# Altium project Lipo-A.PrjPcb
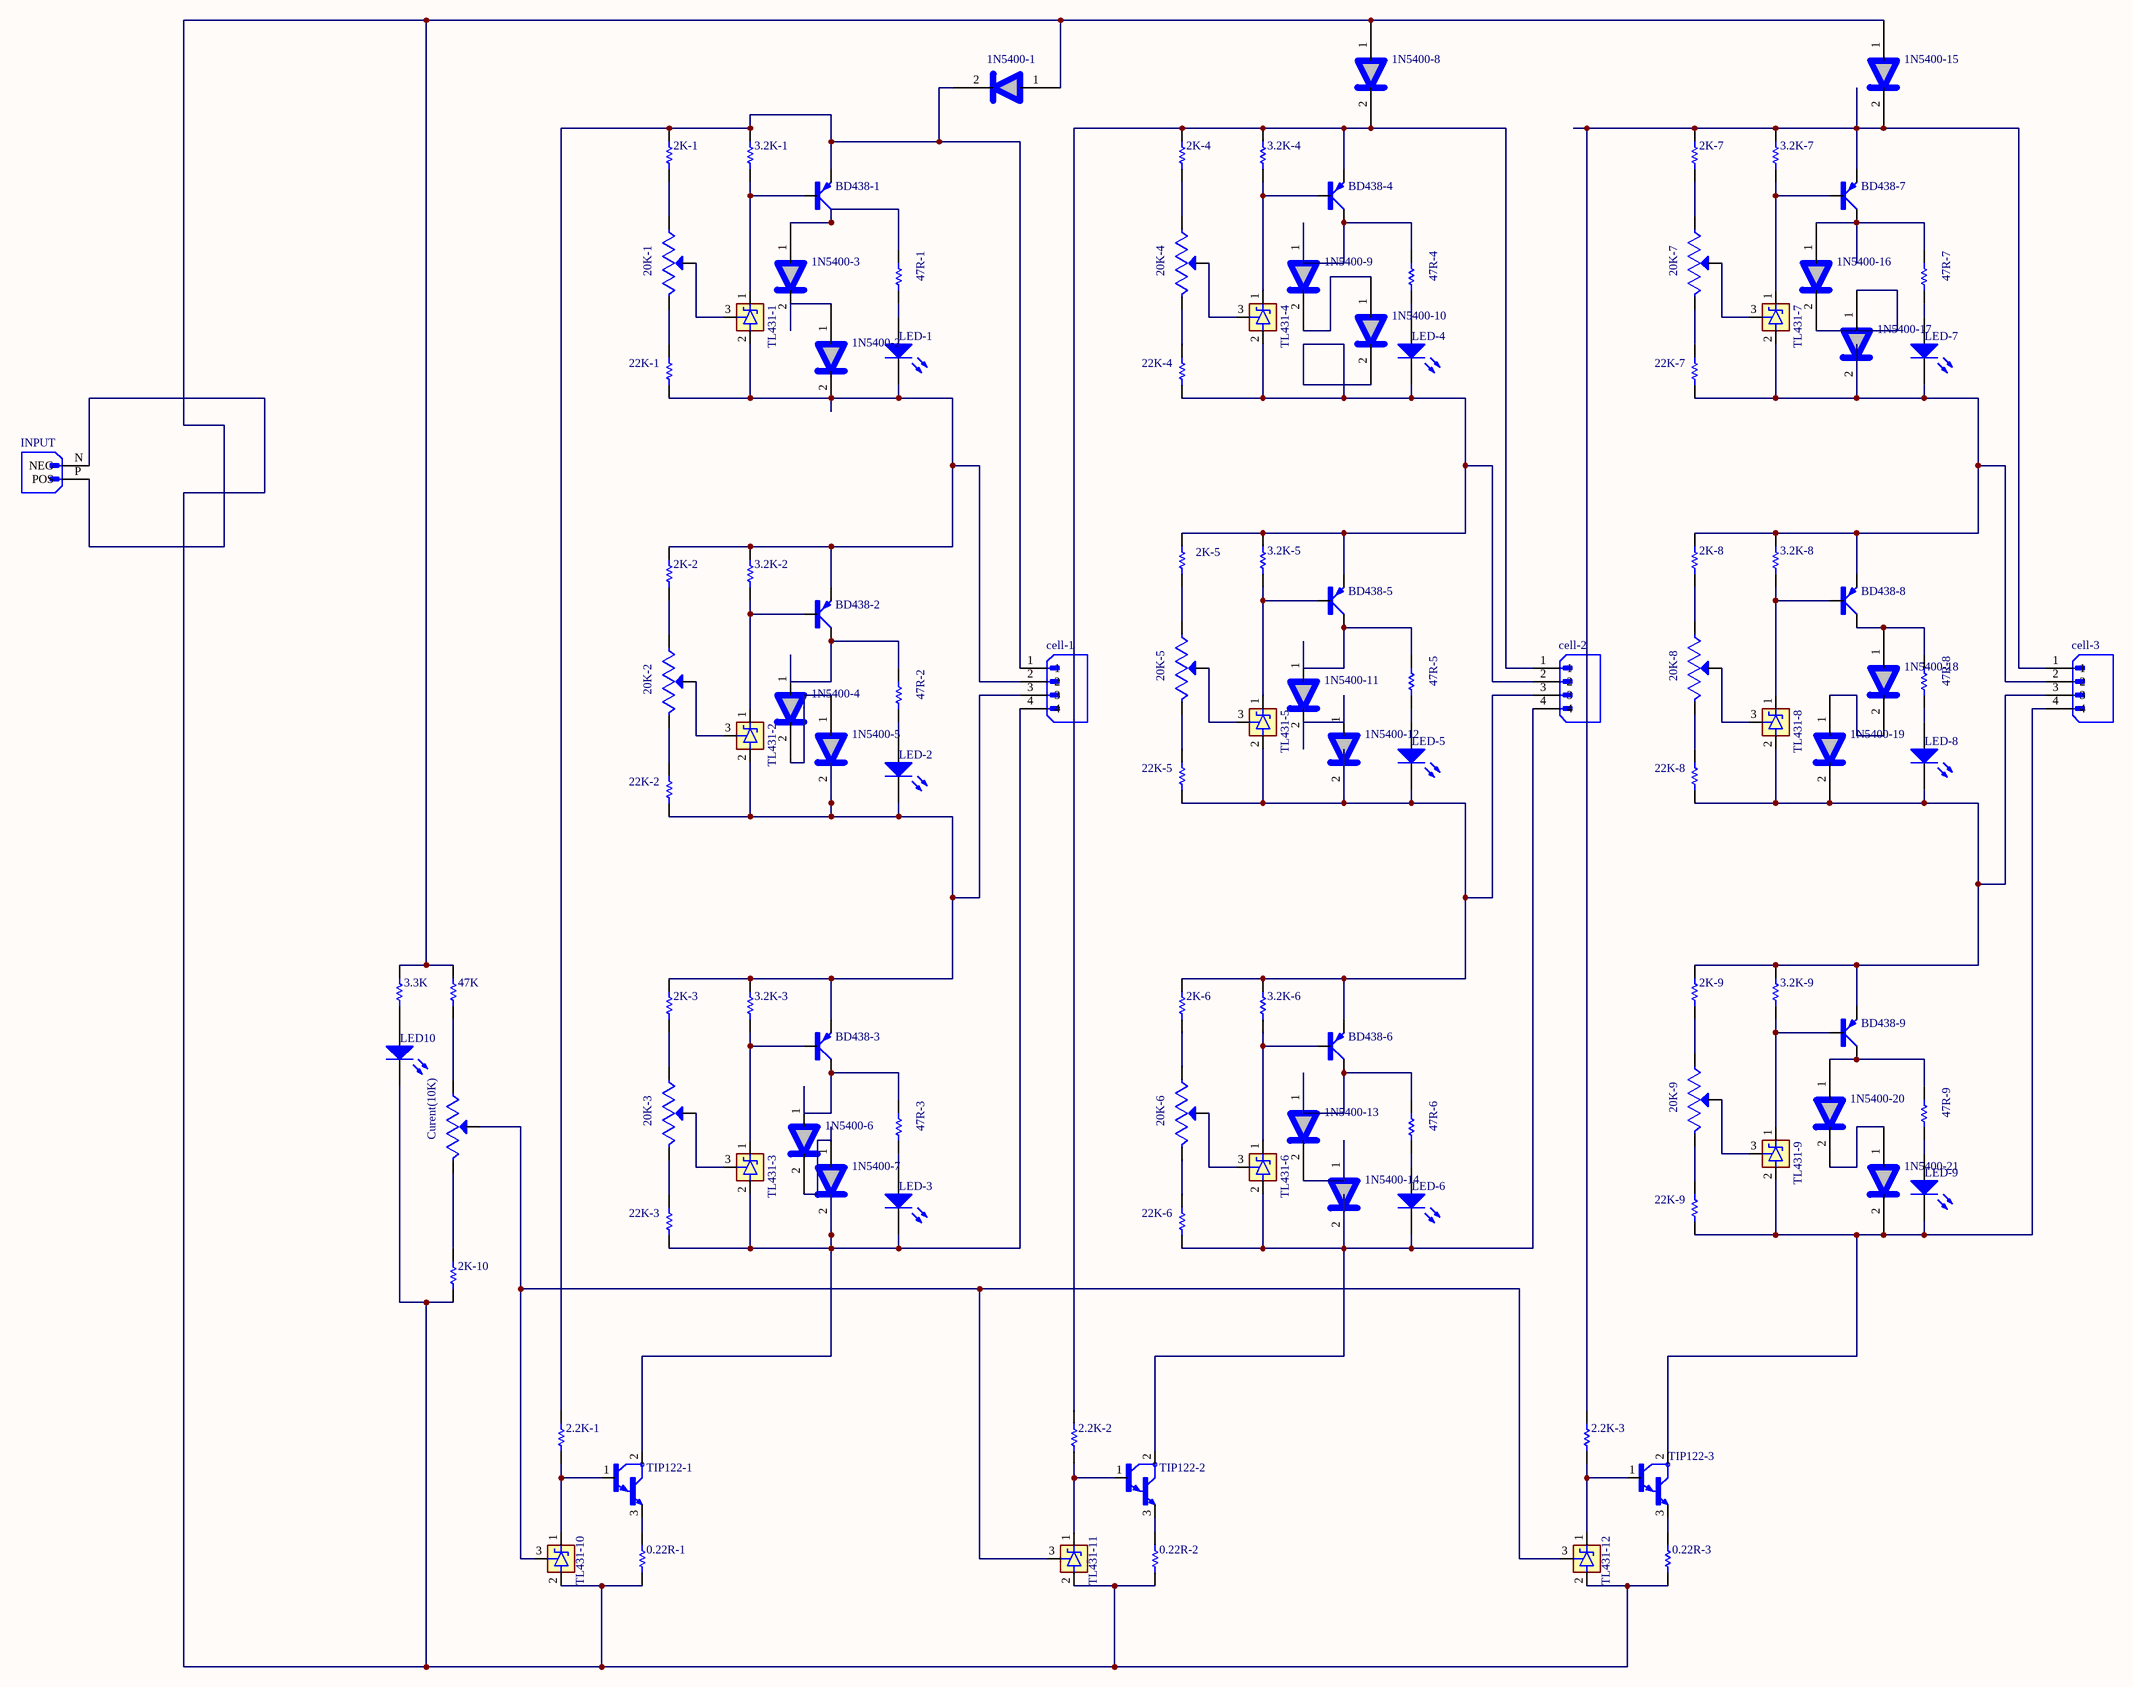
[diagram p0: Sheet2.SchDoc]
1 sheet, 114 parts. Net scope: global (net labels, ports and power ports of the same name join across sheets).
Board file: PCB1.PcbDoc

## Sheet Sheet2.SchDoc
size A2

### Parts
0.22R-1  (no value)  [AXIAL-0.3]
0.22R-2  (no value)  [AXIAL-0.3]
0.22R-3  (no value)  [AXIAL-0.3]
1N5400-1  (no value)  [PCBComponent_1]
1N5400-2  (no value)  [PCBComponent_1]
1N5400-3  (no value)  [PCBComponent_1]
1N5400-4  (no value)  [PCBComponent_1]
1N5400-5  (no value)  [PCBComponent_1]
1N5400-6  (no value)  [PCBComponent_1]
1N5400-7  (no value)  [PCBComponent_1]
1N5400-8  (no value)  [PCBComponent_1]
1N5400-9  (no value)  [PCBComponent_1]
1N5400-10  (no value)  [PCBComponent_1]
1N5400-11  (no value)  [PCBComponent_1]
1N5400-12  (no value)  [PCBComponent_1]
1N5400-13  (no value)  [PCBComponent_1]
1N5400-14  (no value)  [PCBComponent_1]
1N5400-15  (no value)  [PCBComponent_1]
1N5400-16  (no value)  [PCBComponent_1]
1N5400-17  (no value)  [PCBComponent_1]
1N5400-18  (no value)  [PCBComponent_1]
1N5400-19  (no value)  [PCBComponent_1]
1N5400-20  (no value)  [PCBComponent_1]
1N5400-21  (no value)  [PCBComponent_1]
2.2K-1  (no value)  [AXIAL-0.3]
2.2K-2  (no value)  [AXIAL-0.3]
2.2K-3  (no value)  [AXIAL-0.3]
2K-1  (no value)  [AXIAL-0.3]
2K-2  (no value)  [AXIAL-0.3]
2K-3  (no value)  [AXIAL-0.3]
2K-4  (no value)  [AXIAL-0.3]
2K-5  (no value)  [AXIAL-0.3]
2K-6  (no value)  [AXIAL-0.3]
2K-7  (no value)  [AXIAL-0.3]
2K-8  (no value)  [AXIAL-0.3]
2K-9  (no value)  [AXIAL-0.3]
2K-10  (no value)  [AXIAL-0.3]
3.2K-1  (no value)  [AXIAL-0.3]
3.2K-2  (no value)  [AXIAL-0.3]
3.2K-3  (no value)  [AXIAL-0.3]
3.2K-4  (no value)  [AXIAL-0.3]
3.2K-5  (no value)  [AXIAL-0.3]
3.2K-6  (no value)  [AXIAL-0.3]
3.2K-7  (no value)  [AXIAL-0.3]
3.2K-8  (no value)  [AXIAL-0.3]
3.2K-9  (no value)  [AXIAL-0.3]
3.3K  (no value)  [AXIAL-0.3]
20K-1  (no value)  [TRIM_3296W-FM1-502]
20K-2  (no value)  [TRIM_3296W-FM1-502]
20K-3  (no value)  [TRIM_3296W-FM1-502]
20K-4  (no value)  [TRIM_3296W-FM1-502]
20K-5  (no value)  [TRIM_3296W-FM1-502]
20K-6  (no value)  [TRIM_3296W-FM1-502]
20K-7  (no value)  [TRIM_3296W-FM1-502]
20K-8  (no value)  [TRIM_3296W-FM1-502]
20K-9  (no value)  [TRIM_3296W-FM1-502]
22K-1  (no value)  [AXIAL-0.3]
22K-2  (no value)  [AXIAL-0.3]
22K-3  (no value)  [AXIAL-0.3]
22K-4  (no value)  [AXIAL-0.3]
22K-5  (no value)  [AXIAL-0.3]
22K-6  (no value)  [AXIAL-0.3]
22K-7  (no value)  [AXIAL-0.3]
22K-8  (no value)  [AXIAL-0.3]
22K-9  (no value)  [AXIAL-0.3]
47K  (no value)  [AXIAL-0.3]
47R-1  (no value)  [AXIAL-0.3]
47R-2  (no value)  [AXIAL-0.3]
47R-3  (no value)  [AXIAL-0.3]
47R-4  (no value)  [AXIAL-0.3]
47R-5  (no value)  [AXIAL-0.3]
47R-6  (no value)  [AXIAL-0.3]
47R-7  (no value)  [AXIAL-0.3]
47R-8  (no value)  [AXIAL-0.3]
47R-9  (no value)  [AXIAL-0.3]
BD438-1  (no value)  [TO126AV]
BD438-2  (no value)  [TO126AV]
BD438-3  (no value)  [TO126AV]
BD438-4  (no value)  [TO126AV]
BD438-5  (no value)  [TO126AV]
BD438-6  (no value)  [TO126AV]
BD438-7  (no value)  [TO126AV]
BD438-8  (no value)  [TO126AV]
BD438-9  (no value)  [TO126AV]
cell-1  (no value)  [JST_B4B-XH-A(LF)(SN)]
cell-2  (no value)  [JST_B4B-XH-A(LF)(SN)]
cell-3  (no value)  [JST_B4B-XH-A(LF)(SN)]
Curent(10K)  (no value)  [TRIM_3296W-FM1-502]
INPUT  (no value)  [AMASS_XT60-M]
LED10  (no value)  [LED-1]
LED-1  (no value)  [LED-1]
LED-2  (no value)  [LED-1]
LED-3  (no value)  [LED-1]
LED-4  (no value)  [LED-1]
LED-5  (no value)  [LED-1]
LED-6  (no value)  [LED-1]
LED-7  (no value)  [LED-1]
LED-8  (no value)  [LED-1]
LED-9  (no value)  [LED-1]
TIP122-1  (no value)  [TO254P1009X445X1985-3]
TIP122-2  (no value)  [TO254P1009X445X1985-3]
TIP122-3  (no value)  [TO254P1009X445X1985-3]
TL431-1  (no value)  [TO-92]
TL431-2  (no value)  [TO-92]
TL431-3  (no value)  [TO-92]
TL431-4  (no value)  [TO-92]
TL431-5  (no value)  [TO-92]
TL431-6  (no value)  [TO-92]
TL431-7  (no value)  [TO-92]
TL431-8  (no value)  [TO-92]
TL431-9  (no value)  [TO-92]
TL431-10  (no value)  [TO-92]
TL431-11  (no value)  [TO-92]
TL431-12  (no value)  [TO-92]

### Nets
Net0.22R-1_1: 0.22R-1.1 0.22R-2.1 0.22R-3.1 2K-10.1 INPUT.N(NEG) LED10.2(K) TL431-10.2(ANODE) TL431-11.2(ANODE) TL431-12.2(ANODE)
Net0.22R-1_2: 0.22R-1.2 TIP122-1.3(E)
Net0.22R-2_2: 0.22R-2.2 TIP122-2.3(E)
Net0.22R-3_2: 0.22R-3.2 TIP122-3.3(E)
Net1N5400-1_1: 1N5400-1.1 1N5400-8.1 1N5400-15.1 3.3K.2 47K.2 INPUT.P(POS)
Net1N5400-1_2: 1N5400-1.2 2.2K-1.2 2K-1.2 3.2K-1.1 BD438-1.E cell-1.1
Net1N5400-2_1: 1N5400-2.1 1N5400-3.2
Net1N5400-2_2: 1N5400-2.2 2K-2.2 3.2K-2.1 22K-1.2 BD438-2.E cell-1.2 LED-1.2(K) TL431-1.2(ANODE)
Net1N5400-3_1: 1N5400-3.1 47R-1.1 BD438-1.C
Net1N5400-4_1: 1N5400-4.1 47R-2.1 BD438-2.C
Net1N5400-4_2: 1N5400-4.2 1N5400-5.1
Net1N5400-5_2: 1N5400-5.2 2K-3.2 3.2K-3.1 22K-2.2 BD438-3.E cell-1.3 LED-2.2(K) TL431-2.2(ANODE)
Net1N5400-6_1: 1N5400-6.1 47R-3.1 BD438-3.C
Net1N5400-6_2: 1N5400-6.2 1N5400-7.1
Net1N5400-7_2: 1N5400-7.2 22K-3.2 cell-1.4 LED-3.2(K) TIP122-1.2(C) TL431-3.2(ANODE)
Net1N5400-8_2: 1N5400-8.2 2.2K-2.2 2K-4.2 3.2K-4.1 BD438-4.E cell-2.1
Net1N5400-9_1: 1N5400-9.1 47R-4.1 BD438-4.C
Net1N5400-9_2: 1N5400-9.2 1N5400-10.1
Net1N5400-10_2: 1N5400-10.2 2K-5.2 3.2K-5.1 22K-4.2 BD438-5.E cell-2.2 LED-4.2(K) TL431-4.2(ANODE)
Net1N5400-11_1: 1N5400-11.1 47R-5.1 BD438-5.C
Net1N5400-11_2: 1N5400-11.2 1N5400-12.1
Net1N5400-12_2: 1N5400-12.2 2K-6.2 3.2K-6.1 22K-5.2 BD438-6.E cell-2.3 LED-5.2(K) TL431-5.2(ANODE)
Net1N5400-13_1: 1N5400-13.1 47R-6.1 BD438-6.C
Net1N5400-13_2: 1N5400-13.2 1N5400-14.1
Net1N5400-14_2: 1N5400-14.2 22K-6.2 cell-2.4 LED-6.2(K) TIP122-2.2(C) TL431-6.2(ANODE)
Net1N5400-15_2: 1N5400-15.2 2.2K-3.2 2K-7.2 3.2K-7.1 BD438-7.E cell-3.1
Net1N5400-16_1: 1N5400-16.1 47R-7.1 BD438-7.C
Net1N5400-16_2: 1N5400-16.2 1N5400-17.1
Net1N5400-17_2: 1N5400-17.2 2K-8.2 3.2K-8.1 22K-7.2 BD438-8.E cell-3.2 LED-7.2(K) TL431-7.2(ANODE)
Net1N5400-18_1: 1N5400-18.1 47R-8.1 BD438-8.C
Net1N5400-18_2: 1N5400-18.2 1N5400-19.1
Net1N5400-19_2: 1N5400-19.2 2K-9.2 3.2K-9.1 22K-8.2 BD438-9.E cell-3.3 LED-8.2(K) TL431-8.2(ANODE)
Net1N5400-20_1: 1N5400-20.1 47R-9.1 BD438-9.C
Net1N5400-20_2: 1N5400-20.2 1N5400-21.1
Net1N5400-21_2: 1N5400-21.2 22K-9.2 cell-3.4 LED-9.2(K) TIP122-3.2(C) TL431-9.2(ANODE)
Net2.2K-1_1: 2.2K-1.1 TIP122-1.1(B) TL431-10.1(CATHODE)
Net2.2K-2_1: 2.2K-2.1 TIP122-2.1(B) TL431-11.1(CATHODE)
Net2.2K-3_1: 2.2K-3.1 TIP122-3.1(B) TL431-12.1(CATHODE)
Net2K-1_1: 2K-1.1 20K-1.1(CCW)
Net2K-2_1: 2K-2.1 20K-2.1(CCW)
Net2K-3_1: 2K-3.1 20K-3.1(CCW)
Net2K-4_1: 2K-4.1 20K-4.1(CCW)
Net2K-5_1: 2K-5.1 20K-5.1(CCW)
Net2K-6_1: 2K-6.1 20K-6.1(CCW)
Net2K-7_1: 2K-7.1 20K-7.1(CCW)
Net2K-8_1: 2K-8.1 20K-8.1(CCW)
Net2K-9_1: 2K-9.1 20K-9.1(CCW)
Net2K-10_2: 2K-10.2 Curent(10K).3(CW)
Net3.2K-1_2: 3.2K-1.2 BD438-1.B TL431-1.1(CATHODE)
Net3.2K-2_2: 3.2K-2.2 BD438-2.B TL431-2.1(CATHODE)
Net3.2K-3_2: 3.2K-3.2 BD438-3.B TL431-3.1(CATHODE)
Net3.2K-4_2: 3.2K-4.2 BD438-4.B TL431-4.1(CATHODE)
Net3.2K-5_2: 3.2K-5.2 BD438-5.B TL431-5.1(CATHODE)
Net3.2K-6_2: 3.2K-6.2 BD438-6.B TL431-6.1(CATHODE)
Net3.2K-7_2: 3.2K-7.2 BD438-7.B TL431-7.1(CATHODE)
Net3.2K-8_2: 3.2K-8.2 BD438-8.B TL431-8.1(CATHODE)
Net3.2K-9_2: 3.2K-9.2 BD438-9.B TL431-9.1(CATHODE)
Net3.3K_1: 3.3K.1 LED10.1(A)
Net20K-1_2: 20K-1.2(WIPER) TL431-1.3(REF)
Net20K-1_3: 20K-1.3(CW) 22K-1.1
Net20K-2_2: 20K-2.2(WIPER) TL431-2.3(REF)
Net20K-2_3: 20K-2.3(CW) 22K-2.1
Net20K-3_2: 20K-3.2(WIPER) TL431-3.3(REF)
Net20K-3_3: 20K-3.3(CW) 22K-3.1
Net20K-4_2: 20K-4.2(WIPER) TL431-4.3(REF)
Net20K-4_3: 20K-4.3(CW) 22K-4.1
Net20K-5_2: 20K-5.2(WIPER) TL431-5.3(REF)
Net20K-5_3: 20K-5.3(CW) 22K-5.1
Net20K-6_2: 20K-6.2(WIPER) TL431-6.3(REF)
Net20K-6_3: 20K-6.3(CW) 22K-6.1
Net20K-7_2: 20K-7.2(WIPER) TL431-7.3(REF)
Net20K-7_3: 20K-7.3(CW) 22K-7.1
Net20K-8_2: 20K-8.2(WIPER) TL431-8.3(REF)
Net20K-8_3: 20K-8.3(CW) 22K-8.1
Net20K-9_2: 20K-9.2(WIPER) TL431-9.3(REF)
Net20K-9_3: 20K-9.3(CW) 22K-9.1
Net47K_1: 47K.1 Curent(10K).1(CCW)
Net47R-1_2: 47R-1.2 LED-1.1(A)
Net47R-2_2: 47R-2.2 LED-2.1(A)
Net47R-3_2: 47R-3.2 LED-3.1(A)
Net47R-4_2: 47R-4.2 LED-4.1(A)
Net47R-5_2: 47R-5.2 LED-5.1(A)
Net47R-6_2: 47R-6.2 LED-6.1(A)
Net47R-7_2: 47R-7.2 LED-7.1(A)
Net47R-8_2: 47R-8.2 LED-8.1(A)
Net47R-9_2: 47R-9.2 LED-9.1(A)
NetCurent(10K)_2: Curent(10K).2(WIPER) TL431-10.3(REF) TL431-11.3(REF) TL431-12.3(REF)

### Library data of the parts
0.22R-1-0.22R-3 2.2K-1-2.2K-3 2K-1-2K-10 3.2K-1-3.2K-9 3.3K 22K-1-22K-9 47K 47R-1-47R-9 = Res1: Resistor; Published: 8-Jun-2000; LatestRevisionDate: 17-Jul-2002; LatestRevisionNote: Re-released for DXP Platform.; PackageReference: AXIAL-0.3; Publisher: Altium Limited; PackageDescription: Axial Device, Thru-Hole; 2 Leads; 0.3 in Pin Spacing
1N5400-1-1N5400-21 = 1N5400-
20K-1-20K-9 Curent(10K) = 3296W-FM1-502: Trimmer Resistors - Through Hole; MF: Bourns; MP: 3296W-FM1-502; Availability: Warning; SnapEDA_Link: https://www.snapeda.com/parts/3296W-FM1-502/Bourns/view-part/3211169/?ref=snap; Package: None; Price: None; Value: *; Check_prices: https://www.snapeda.com/parts/3296W-FM1-502/Bourns/view-part/3211169/?ref=eda
BD438-1-BD438-9 = BD438: Bipolar (BJT) Transistor PNP 45V 4A 3MHz 36W Through Hole SOT-32-3; MF: ON; Purchase-URL: https://pricing.snapeda.com/search/part/BD438/?ref=eda; Package: TO-126 STMicroelectronics; Check_prices: https://www.snapeda.com/parts/BD438/Onsemi/view-part/496837/?ref=eda; Value: *; MP: BD438; Price: None; Availability: In Stock; SnapEDA_Link: https://www.snapeda.com/parts/BD438/Onsemi/view-part/496837/?ref=snap
cell-1-cell-3 = B4B-XH-A(LF)(SN): Connector Header Through Hole 4 position 0.098 (2.50mm); MF: JST Sales; SnapEDA_Link: https://www.snapeda.com/parts/B4B-XH-A(LF)(SN)/JST+Sales+America+Inc./view-part/?ref=snap; Package: None; MP: B4B-XH-A(LF)(SN); Check_prices: https://www.snapeda.com/parts/B4B-XH-A(LF)(SN)/JST+Sales+America+Inc./view-part/?ref=eda; Purchase-URL: https://pricing.snapeda.com/search/part/B4B-XH-A(LF)(SN)/?ref=eda; Price: None; Value: *; Availability: In Stock
INPUT = XT60-M: Plug; DC supply; XT60; male; PIN: 2; for cable; soldered; 30A; 500V; MF: AMASS; Price: None; Availability: Not in stock; Package: Package; MP: XT60-M; Value: *; SnapEDA_Link: https://www.snapeda.com/parts/XT60-M/AMASS/view-part/?ref=snap; Check_prices: https://www.snapeda.com/parts/XT60-M/AMASS/view-part/?ref=eda
LED10 LED-1-LED-9 = LED1: Typical RED GaAs LED; Published: 8-Jun-2000; LatestRevisionDate: 08-Jul-2005; LatestRevisionNote: Mech Layer 1 removed.; PackageReference: LED-1; Publisher: Altium Limited; PackageDescription: LED; 2 Leads
TIP122-1-TIP122-3 = TIP122G: Bipolar (BJT) Transistor NPN - Darlington 100V 5A 2W Through Hole TO-220AB; MF: ON Semiconductor; Check_prices: https://www.snapeda.com/parts/TIP122G/ON%20Semiconductor/view-part/385313/?ref=eda; Price: None; SnapEDA_Link: https://www.snapeda.com/parts/TIP122G/ON%20Semiconductor/view-part/385313/?ref=snap; Package: None; Purchase-URL: https://pricing.snapeda.com/search/part/TIP122G/?ref=eda; Availability: Good; Value: *; MP: TIP122G
TL431-1-TL431-12 = TL431CLP: Adjustable precision shunt regulator 3-TO-92 0 to 70; Availability: Unavailable; Price: None; Package: None; MP: TL431CLP; Value: *